# EAGLE design moottoriohjain (EAGLE 7.3.0)
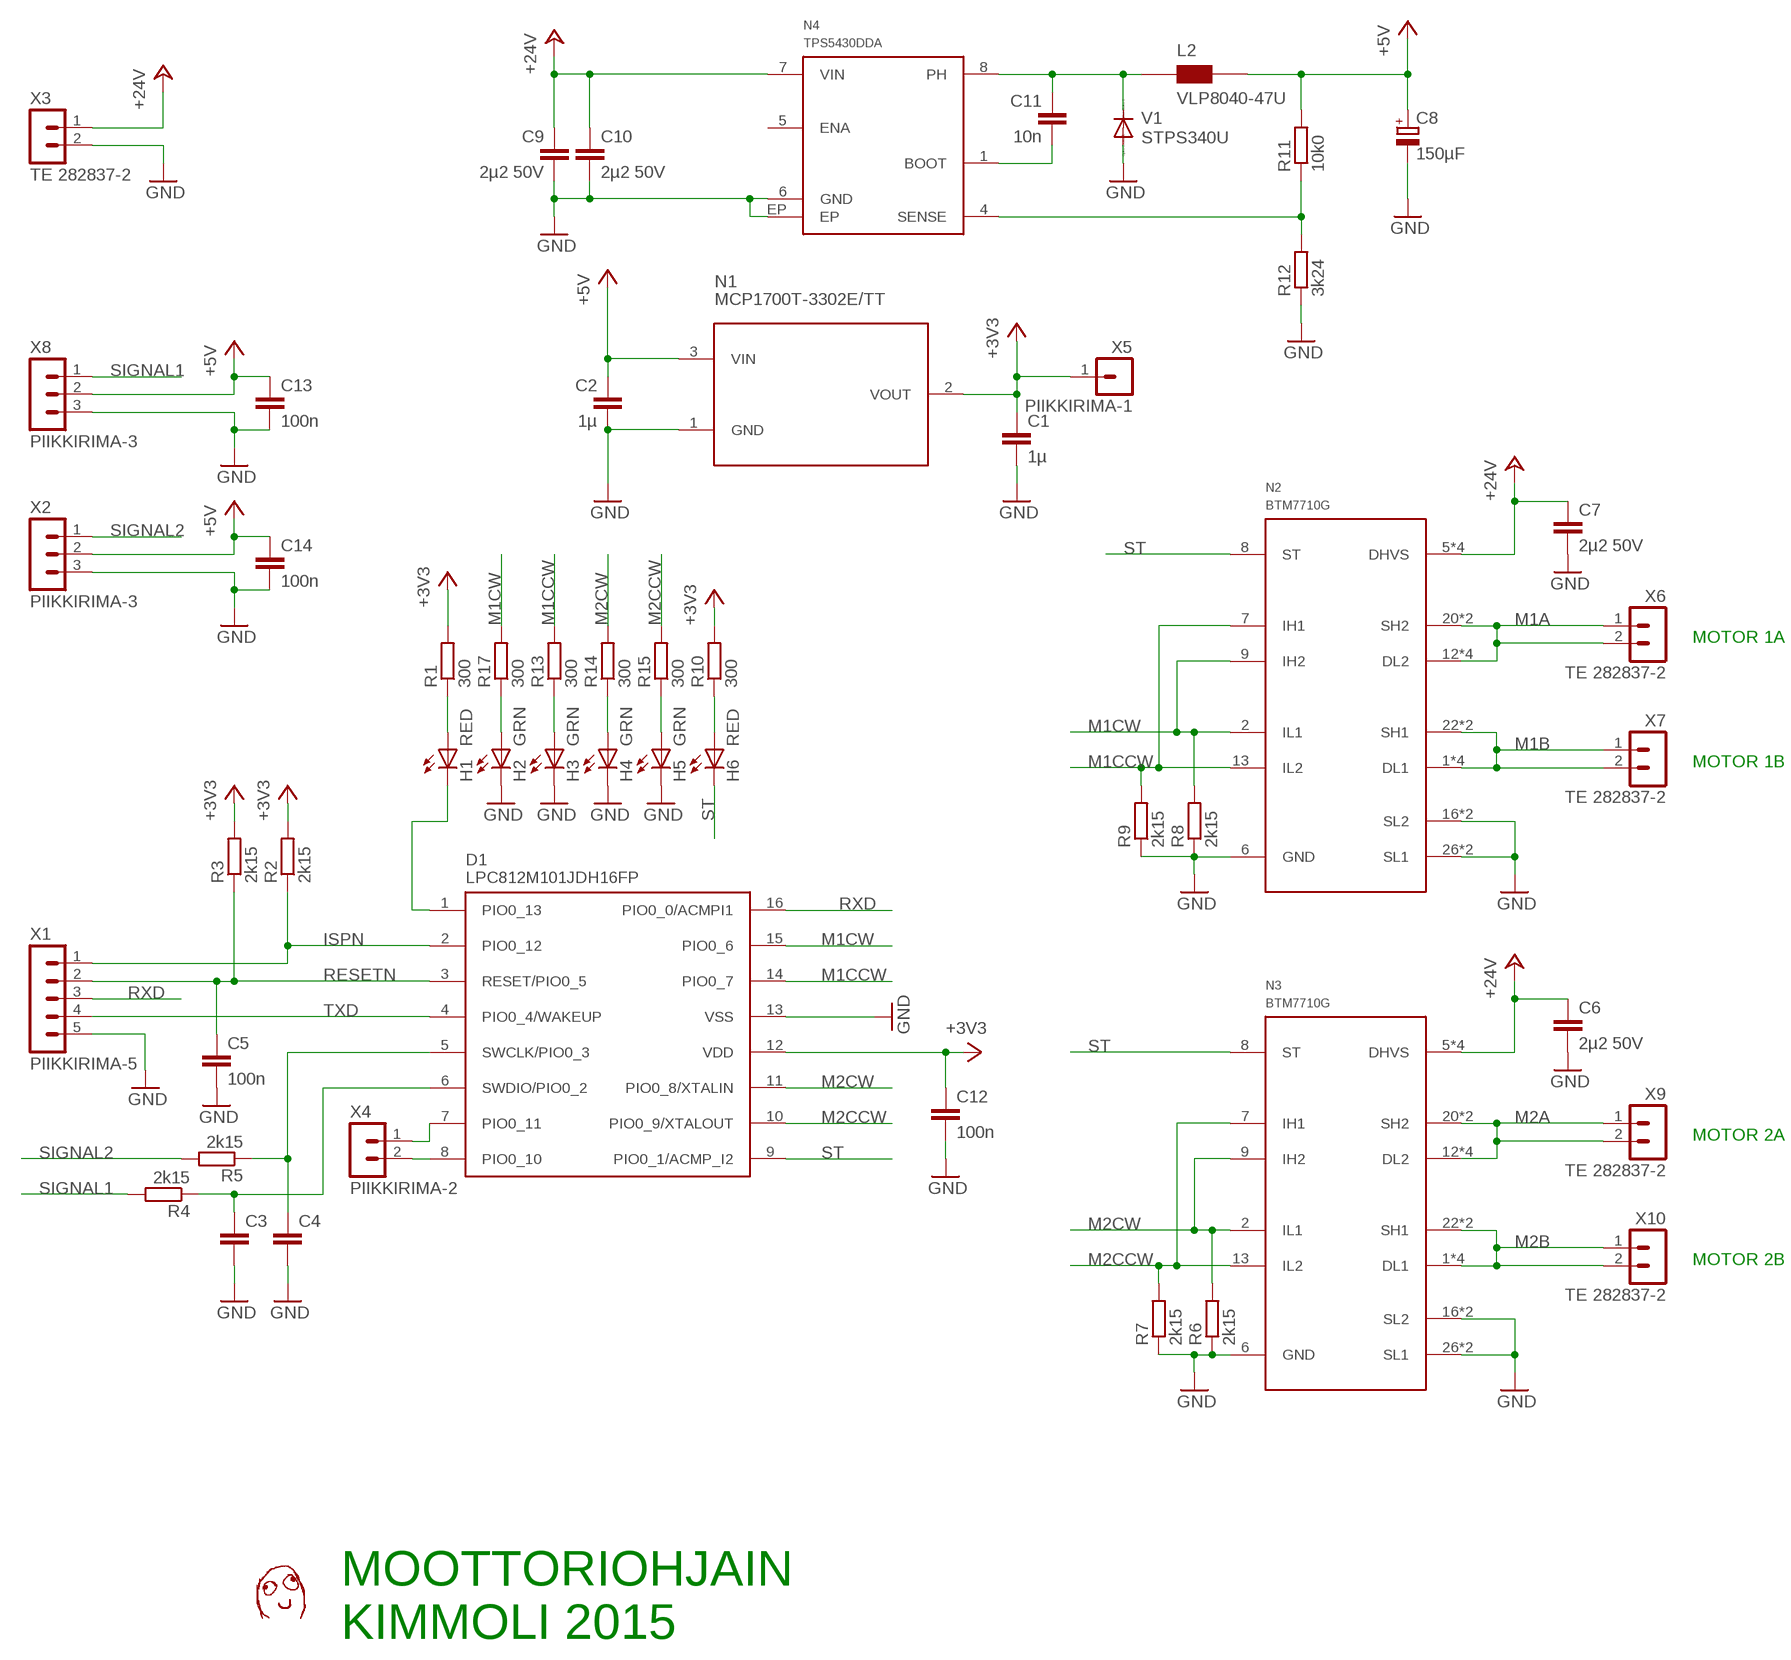
[diagram p0: schematic, sheet 1]

## Parts
C1  1µ  CAP0805  [C0805]
C2  1µ  CAP0805  [C0805]
C3  CAP0603  [C0603]
C4  CAP0603  [C0603]
C5  100n  CAP0603  [C0603]
C6  2µ2 50V  CAP0805  [C0805]
C7  2µ2 50V  CAP0805  [C0805]
C8  150µF  CPOL-EUCT7343  [CT7343]
C9  2µ2 50V  CAP0805  [C0805]
C10  2µ2 50V  CAP0805  [C0805]
C11  10n  CAP0603  [C0603]
C12  100n  CAP0603  [C0603]
C13  100n  CAP0603  [C0603]
C14  100n  CAP0603  [C0603]
D1  LPC812M101JDH16FP  SEB_LPC81X  [SEB_TSSOP16]
H1  RED  LEDCHIP-LED0603  [CHIP-LED0603]
H2  GRN  LEDCHIP-LED0603  [CHIP-LED0603]
H3  GRN  LEDCHIP-LED0603  [CHIP-LED0603]
H4  GRN  LEDCHIP-LED0603  [CHIP-LED0603]
H5  GRN  LEDCHIP-LED0603  [CHIP-LED0603]
H6  RED  LEDCHIP-LED0603  [CHIP-LED0603]
L2  VLP8040-47U  [VLP8040]
N1  MCP1700T-3302E/TT  MCP1700T-1802E/TT  [SOT23]
N2  BTM7710G  [SOIC28-W_MC]
N3  BTM7710G  [SOIC28-W_MC]
N4  TPS5430DDA  [SOIC8-N-EP]
R1  300  RES0603  [R0603]
R2  2k15  RES0603  [R0603]
R3  2k15  RES0603  [R0603]
R4  2k15  RES0603  [R0603]
R5  2k15  RES0603  [R0603]
R6  2k15  RES0603  [R0603]
R7  2k15  RES0603  [R0603]
R8  2k15  RES0603  [R0603]
R9  2k15  RES0603  [R0603]
R10  300  RES0603  [R0603]
R11  10k0  RES0603  [R0603]
R12  3k24  RES0603  [R0603]
R13  300  RES0603  [R0603]
R14  300  RES0603  [R0603]
R15  300  RES0603  [R0603]
R17  300  RES0603  [R0603]
U$1  DAFUG  [DAFUG]
V1  STPS340U  DIODE-SMB  [SMB]
X1  PIIKKIRIMA-5  [PIIKKIRIMA-5]
X2  PIIKKIRIMA-3  [PIIKKIRIMA-3]
X3  TE 282837-2  TE_RUUVILIITIN2  [TE_RUUVILIITIN2]
X4  PIIKKIRIMA-2  [PIIKKIRIMA-2]
X5  PIIKKIRIMA-1  [PIIKKIRIMA-1]
X6  TE 282837-2  TE_RUUVILIITIN2  [TE_RUUVILIITIN2]
X7  TE 282837-2  TE_RUUVILIITIN2  [TE_RUUVILIITIN2]
X8  PIIKKIRIMA-3  [PIIKKIRIMA-3]
X9  TE 282837-2  TE_RUUVILIITIN2  [TE_RUUVILIITIN2]
X10  TE 282837-2  TE_RUUVILIITIN2  [TE_RUUVILIITIN2]

## Nets
+3V3: C1.1 C12.1 D1.12(VDD) N1.2(VOUT) R1.2 R2.2 R3.2 R10.2 X5.1
+5V: C2.1 C8.+ C13.1 C14.1 L2.2(B) N1.3(VIN) R11.2 X2.2 X8.2
+24V: C6.1 C7.1 C9.1 C10.1 N2.5(DHVS) N2.10(DHVS) N2.19(DHVS) N2.24(DHVS) N3.5(DHVS) N3.10(DHVS) N3.19(DHVS) N3.24(DHVS) N4.7(VIN) X3.1
GND: C1.2 C2.2 C3.2 C4.2 C5.2 C6.2 C7.2 C8.- C9.2 C10.2 C12.2 C13.2 C14.2 D1.13(VSS) H2.C H3.C H4.C H5.C N1.1(GND) N2.6(GND) N2.16(SL2) N2.17(SL2) N2.26(SL1) N2.27(SL1) N3.6(GND) N3.16(SL2) N3.17(SL2) N3.26(SL1) N3.27(SL1) N4.6(GND) N4.EP R6.1 R7.1 R8.1 R9.1 R12.1 V1.A X1.5 X2.3 X3.2 X8.3
ISPN: D1.2(PIO0_12) R2.1 X1.1
M1A: N2.12(DL2) N2.14(DL2) N2.15(DL2) N2.18(DL2) N2.20(SH2) N2.21(SH2) X6.1 X6.2
M1B: N2.1(DL1) N2.3(DL1) N2.22(SH1) N2.23(SH1) N2.25(DL1) N2.28(DL1) X7.1 X7.2
M1CCW: D1.14(PIO0_7) N2.7(IH1) N2.13(IL2) R9.2 R13.2
M1CW: D1.15(PIO0_6) N2.2(IL1) N2.9(IH2) R8.2 R17.2
M2A: N3.12(DL2) N3.14(DL2) N3.15(DL2) N3.18(DL2) N3.20(SH2) N3.21(SH2) X9.1 X9.2
M2B: N3.1(DL1) N3.3(DL1) N3.22(SH1) N3.23(SH1) N3.25(DL1) N3.28(DL1) X10.1 X10.2
M2CCW: D1.10(PIO0_9/XTALOUT) N3.7(IH1) N3.13(IL2) R7.2 R15.2
M2CW: D1.11(PIO0_8/XTALIN) N3.2(IL1) N3.9(IH2) R6.2 R14.2
N$1: C3.1 D1.6(SWDIO/PIO0_2) R4.1
N$2: D1.1(PIO0_13) H1.C
N$3: H1.A R1.1
N$4: C4.1 D1.5(SWCLK/PIO0_3) R5.1
N$5: D1.8(PIO0_10) X4.2
N$6: D1.7(PIO0_11) X4.1
N$9: H2.A R17.1
N$10: H6.A R10.1
N$11: H3.A R13.1
N$12: H4.A R14.1
N$13: H5.A R15.1
N$58: C11.2 N4.1(BOOT)
N$60: N4.4(SENSE) R11.1 R12.2
PH: C11.1 L2.1(A) N4.8(PH) V1.C
RESETN: C5.1 D1.3(RESET/PIO0_5) R3.1 X1.2
RXD: D1.16(PIO0_0/ACMPI1) X1.3
SIGNAL1: R4.2 X8.1
SIGNAL2: R5.2 X2.1
ST: D1.9(PIO0_1/ACMP_I2) H6.C N2.8(ST) N3.8(ST)
TXD: D1.4(PIO0_4/WAKEUP) X1.4
Unconnected: N4.5(ENA)

## Notes on the sheet
- MOTOR 1A
- MOTOR 1B
- MOTOR 2A
- MOTOR 2B
- MOOTTORIOHJAIN
- KIMMOLI 2015

## Library data of the parts
C1-C5 C11-C14 = omat_ic_2:CAP
C6 C7 C9 C10 = OMAT_IC:CAP
C8 = EKE:CPOL-EU: POLARIZED CAPACITOR, European symbol
D1 = omat_ic_2:SEB_LPC81X
H1-H6 = omat_ic_2:LED: LED OSRAM: - CHIPLED LG R971, LG N971, LY N971, LG Q971, LY Q971, LO R971, LY R971 LH N974, LH R974 LS Q976, LO Q976, LY Q976 LO Q996 - Hyper CHIPLED LW Q18S LB Q993, LB Q99A, LB R99A - SideLED LS A670, LO A670, LY A670, LG A670, LP A670 LB A673, LV A673, LT A673, LW A673 LH A674 LY A675 LS A676, LA A676, LO A676, LY A676, LW A676 LS A679, LY A679, LG A679 - Hyper Micro SIDELED® LS Y876, LA Y876, LO Y876, LY Y876 LT Y87S - SmartLED LW L88C, LW L88S LB L89C, LB L89S, LG L890 LS L89K, LO L89K, LY L89K LS L896, LA L896, LO L896, LY L896 - TOPLED LS T670, LO T670, LY T670, LG T670, LP T670 LSG T670, LSP T670, LSY T670, LOP T670, LYG T670 LG T671, LOG T671, LSG T671 LB T673, LV T673, LT T673, LW T673 LH T674 LS T676, LA T676, LO T676, LY T676, LB T676, LH T676, LSB T676, LW T676 LB T67C, LV T67C, LT T67C, LS T67K, LO T67K, LY T67K, LW E67C LS E67B, LA E67B, LO E67B, LY E67B, LB E67C, LV E67C, LT E67C LW T67C LS T679, LY T679, LG T679 LS T770, LO T770, LY T770, LG T770, LP T770 LB T773, LV T773, LT T773, LW T773 LH T774 LS E675, LA E675, LY E675, LS T675 LS T776, LA T776, LO T776, LY T776, LB T776 LHGB T686 LT T68C, LB T68C - Hyper Mini TOPLED® LB M676 - Mini TOPLED Santana® LG M470 LS M47K, LO M47K, LY M47K Source: http://www.osram.convergy.de LUXEON: - LUMILED® LXK2-PW12-R00, LXK2-PW12-S00, LXK2-PW14-U00, LXK2-PW14-V00 LXK2-PM12-R00, LXK2-PM12-S00, LXK2-PM14-U00 LXK2-PE12-Q00, LXK2-PE12-R00, LXK2-PE12-S00, LXK2-PE14-T00, LXK2-PE14-U00 LXK2-PB12-K00, LXK2-PB12-L00, LXK2-PB12-M00, LXK2-PB14-N00, LXK2-PB14-P00, LXK2-PB14-Q00 LXK2-PR12-L00, LXK2-PR12-M00, LXK2-PR14-Q00, LXK2-PR14-R00 LXK2-PD12-Q00, LXK2-PD12-R00, LXK2-PD12-S00 LXK2-PH12-R00, LXK2-PH12-S00 LXK2-PL12-P00, LXK2-PL12-Q00, LXK2-PL12-R00 Source: www.luxeon.com KINGBRIGHT: KA-3528ASYC Source: www.kingbright.com
L2 = omat_ic_2:VLP8040
N1 = omat_ic_2:MCP1700T-1802E/TT
N2 N3 = omat_ic_2:BTM7710G
N4 = OMAT_IC:TPS5430
R1-R10 R13-R15 R17 = omat_ic_2:RES
R11 R12 = OMAT_IC:RES
U$1 = dafug:DAFUG
V1 = diode:DIODE-: DIODE
X1 = omat_ic_2:PIIKKIRIMA-5
X2 X8 = omat_ic_2:PIIKKIRIMA-3
X3 X6 X7 X9 X10 = omat_ic_2:TE_RUUVILIITIN2
X4 = omat_ic_2:PIIKKIRIMA-2
X5 = omat_ic_2:PIIKKIRIMA-1

## Board
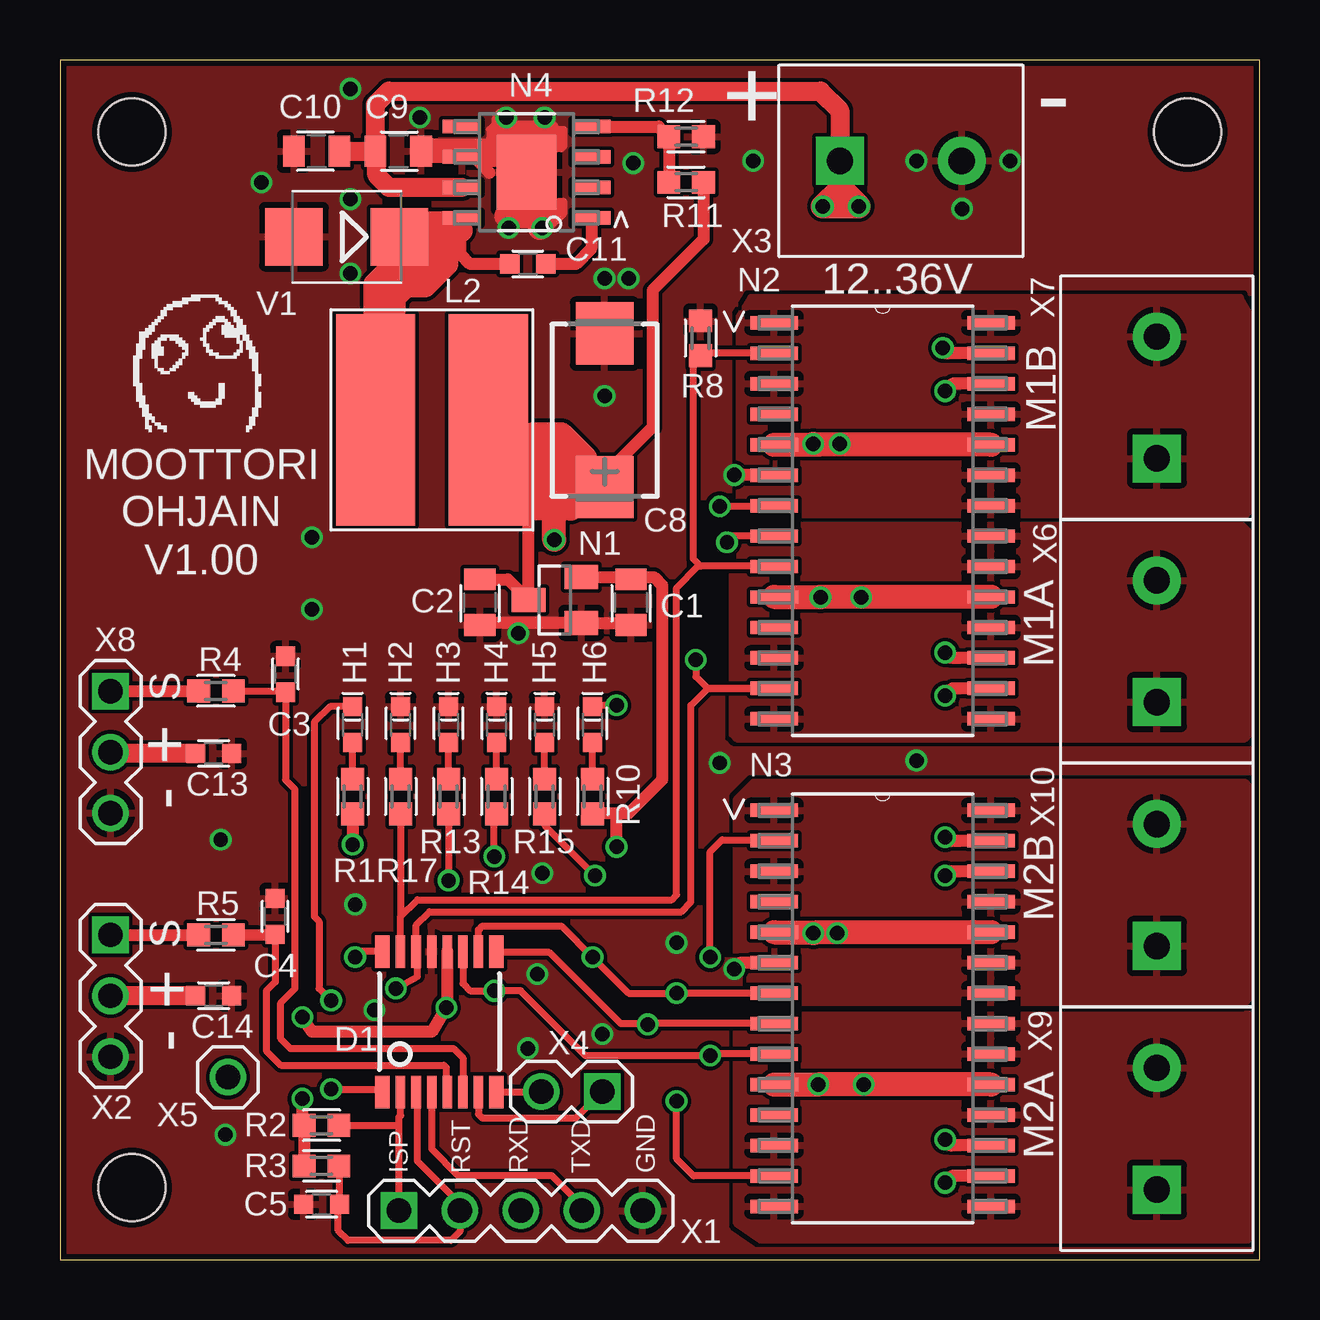
[diagram p1: board, top side]
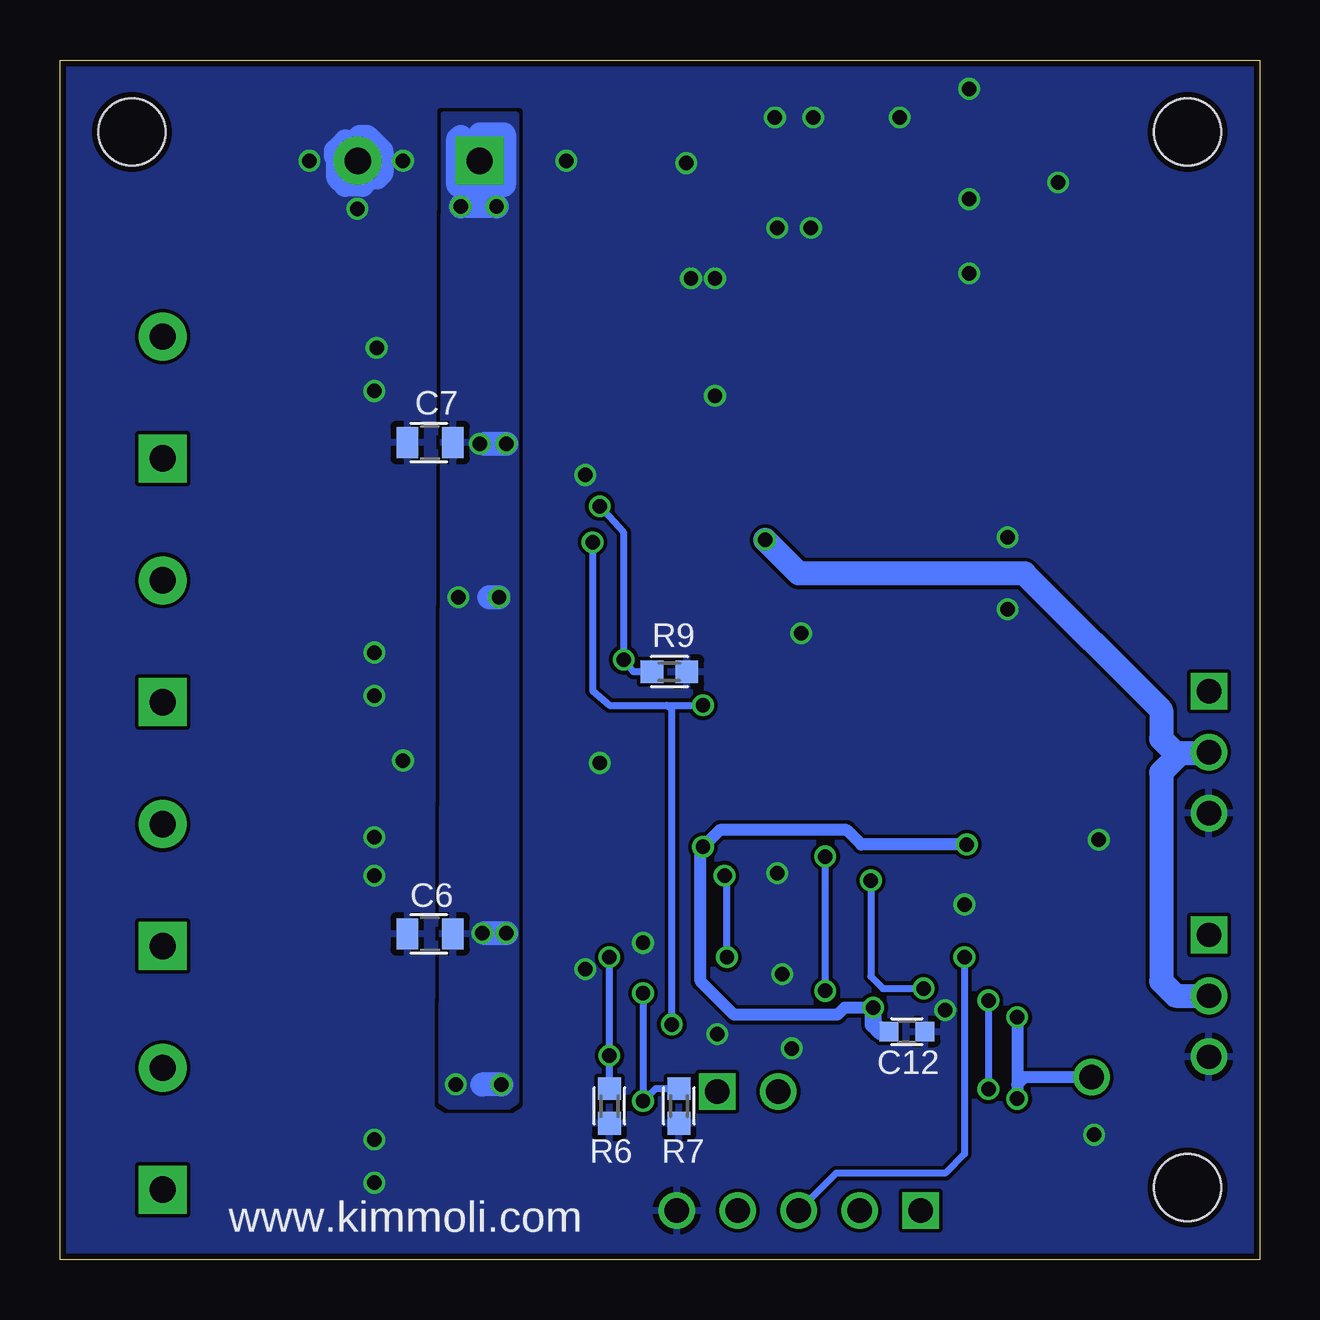
[diagram p2: board, bottom side, seen from below]

Size 50 x 50 mm. Coordinates in mm from the lower left corner, seen from the top.
Outline: 0,0 50,0 50,50 0,50 0,0
Copper layers (1*16): Top 0.035mm / dielectric 1.5mm / Bottom 0.035mm
Design rules "ITEADstudio_DRC": minimum track width 6mil, minimum drill 12mil, track to track 6mil, track to pad 6mil, pad to pad 6mil, via to via 6mil, smd to smd 0mil, copper to edge 10mil, drill to drill 10mil, minimum pad ring 10mil, minimum via ring 6mil, stop-mask expansion 2mil, vias tented up to drill 100mil, thermal gap 10mil
Holes 2.8 mm at 3,3 47,47 3,47

### Footprints (pad centres in the part's own frame; a part is rotated, then mirrored left to right if it is on the bottom)
C0805 = smd 0.9 x 1.3: 1 -0.95,0; 2 0.95,0
C0603 = smd 0.8 x 0.8: 1 -0.75,0; 2 0.75,0
CT7343 = smd 2.6 x 2.4: + 3.2,0; - -3.2,0
SEB_TSSOP16 = smd 0.6 x 1.35: 1 -2.375,-2.925; 8 2.375,-2.925; 9 2.375,2.925; 16 -2.375,2.925 | smd 0.4 x 1.35: 2 -1.625,-2.925; 3 -0.975,-2.925; 4 -0.325,-2.925; 5 0.325,-2.925; 6 0.975,-2.925; 7 1.625,-2.925; 10 1.625,2.925; 11 0.975,2.925; 12 0.325,2.925; 13 -0.325,2.925; 14 -0.975,2.925; 15 -1.625,2.925
CHIP-LED0603 = smd 0.8 x 0.8: A -0.75,0; C 0.75,0
VLP8040 = smd 3.3 x 8.8: 1 -2.35,0; 2 2.35,0
SOT23 = smd 1 x 1.4: 1 -0.95,-1.1; 2 0.95,-1.1; 3 0,1.1
SOIC28-W_MC = smd 1.981 x 0.559: 1 -4.521,8.255; 2 -4.521,6.985; 3 -4.521,5.715; 4 -4.521,4.445; 5 -4.521,3.175; 6 -4.521,1.905; 7 -4.521,0.635; 8 -4.521,-0.635; 9 -4.521,-1.905; 10 -4.521,-3.175; 11 -4.521,-4.445; 12 -4.521,-5.715; 13 -4.521,-6.985; 14 -4.521,-8.255; 15 4.521,-8.255; 16 4.521,-6.985; 17 4.521,-5.715; 18 4.521,-4.445; 19 4.521,-3.175; 20 4.521,-1.905; 21 4.521,-0.635; 22 4.521,0.635; 23 4.521,1.905; 24 4.521,3.175; 25 4.521,4.445; 26 4.521,5.715; 27 4.521,6.985; 28 4.521,8.255
SOIC8-N-EP = smd 1.6 x 0.559: 1 -2.7,1.905; 2 -2.7,0.635; 3 -2.7,-0.635; 4 -2.7,-1.905; 5 2.7,-1.905; 6 2.7,-0.635; 7 2.7,0.635; 8 2.7,1.905 | smd 2.5 x 3.1: EP 0,0
R0603 = smd 0.95 x 0.95: 1 -0.725,0; 2 0.725,0
SMB = smd 2.4 x 2.4: A 2.2,0; C -2.2,0
PIIKKIRIMA-5 = drill 1.016 square: 1 0,0 | drill 1.016: 2 2.54,0; 3 5.08,0; 4 7.62,0; 5 10.16,0
PIIKKIRIMA-3 = drill 1.016 square: 1 0,0 | drill 1.016: 2 2.54,0; 3 5.08,0
TE_RUUVILIITIN2 = drill 1.1 pad 2 square: 1 0,0 | drill 1.1 pad 2: 2 5.08,0
PIIKKIRIMA-2 = drill 1.016 square: 1 0,0 | drill 1.016: 2 2.54,0
PIIKKIRIMA-1 = drill 1.016: 1 0,0

### Placement (x,y rotation side)
C1  23.8,27.4 270 top
C2  17.5,27.4 270 top
C3  9.4,24.4 90 top
C4  8.97,14.3 90 top
C5  10.9,2.3 180 top
C6  34.57,13.57 180 bottom
C7  34.57,34.05 180 bottom
C8  22.7,35.4 270 top
C9  14.1,46.2 0 top
C10  10.7,46.2 180 top
C11  19.5,41.5 0 top
C12  14.7,9.5 0 bottom
C13  6.4,21.1 0 top
C14  6.4,11 0 top
D1  15.82,9.91 0 top
H1  12.2,22.3 90 top
H2  14.2,22.3 90 top
H3  16.2,22.3 90 top
H4  18.2,22.3 90 top
H5  20.2,22.3 90 top
H6  22.2,22.3 90 top
L2  15.5,35 0 top
N1  20.63,27.49 90 top
N2  34.29,30.79 0 top
N3  34.29,10.47 0 top
N4  19.45,45.32 180 top
R1  12.2,19.3 270 top
R2  10.9,5.6 180 top
R3  10.9,3.9 180 top
R4  6.5,23.7 180 top
R5  6.5,13.53 180 top
R6  27.1,6.4 90 bottom
R7  24.2,6.4 90 bottom
R8  26.7,38.4 270 top
R9  24.6,24.5 180 bottom
R10  22.2,19.3 270 top
R11  26.1,44.9 0 top
R12  26.1,46.8 180 top
R13  16.2,19.3 270 top
R14  18.2,19.3 270 top
R15  20.2,19.3 270 top
R17  14.2,19.3 270 top
U$1  5.91,37.1 0 top
V1  11.95,42.63 180 top
X1  14.13,2.04 0 top
X2  2.11,13.53 270 top
X3  32.51,45.8 0 top
X4  22.6,7 180 top
X5  7,7.6 0 top
X6  45.72,23.23 90 top
X7  45.72,33.39 90 top
X8  2.11,23.69 270 top
X9  45.72,2.91 90 top
X10  45.72,13.07 90 top

### Tracks (layer width: path | path; a pad name or v marks a point on that pad's centre or on a via)
+3V3  (via drill 0.6)
  Top 0.5: C1.1 23.71,28.44 N1.2 24.76,28.44 25.1,28.1 25.1,20 23.7,18.6 23.1,18.6 | 23.1,18.6 22.23,18.6 R10.2 | R1.2 v12.2,17.3 | v23.2,17.2 23.2,18.5 23.1,18.6 | D1.12 16.14,10.54 v16.1,10.5 15.5,9.5 10.5,9.5 v10.1,10.1 | R3.2 R2.2 10.1,5.67 v10.1,6.7
  Bottom 0.5: v12.2,17.3 16.6,17.3 17.2,17.9 22.5,17.9 v23.2,17.2 23.3,17.1 23.3,11.6 21.9,10.2 17.6,10.2 17.3,10.5 v16.1,10.5 | v10.1,10.1 10.1,7.3 | 10.1,7.3 v10.1,6.7 | X5.1 9.8,7.6 10.1,7.3
  Bottom 0.7: C12.1 15.8,9.5 16.1,9.8 v16.1,10.5
+5V  (via drill 0.6)
  Top 0.5: R11.2 26.82,42.52 24.7,40.4 24.7,34.7 22.2,32.2 | 19.6,32.3 19.53,32.23 N1.3 18.67,28.35 C2.1
  Top 0.8: C14.1 X2.2 | C13.1 2.16,21.1 X8.2
  Top 1: C8.+ 22.2,32.2 21.3,31.3 19.6,31.3 19.6,32.3 19.6,34.3 19.7,34.4 20.9,34.4 21.9,33.4 21.9,33 20.9,32 20.4,32 20.3,32.1 20.3,33.7 20.5,33.7 20.9,33.3 20.9,32.9 20.5,32.9 | 20.5,32.9 19.95,32.9 L2.2 | v20.6,30 20.6,32.8 20.5,32.9
  Bottom 1: v20.6,30 19.2,28.6 9.8,28.6 4.1,22.9 4.1,21.7 3.5,21.1 3.3,21.1 | X8.2 2.16,21.1 3.3,21.1 | 3.3,21.1 4.1,20.3 4.1,11.6 3.5,11 X2.2
+24V  (via drill 0.6)
  Top 0.8: N4.7 13.71,44.69 13.2,45.2 13.2,46.25 C9.1 | C9.1 13.15,48.15 13.7,48.7 31.7,48.7 32.5,47.9 32.5,46.09 X3.1 | C10.1 C9.1
  Top 1: N2.5 31.57,33.97 v31.4,34 31.64,33.97 N2.24 | N2.19 31.71,27.61 v31.7,27.6 31.68,27.61 N2.10 | N3.5 31.55,13.64 v31.4,13.6 31.64,13.64 N3.24 | N3.10 v31.59,7.29 v31.6,7.3 v31.61,7.29 N3.19 | X3.1 32.5,44.7 | 32.5,44.7 32.5,44.6 v31.8,43.9 v33.3,43.9 32.5,44.7
  Bottom 0.3: X3.1 32.28,46.08 32.2,46
  Bottom 1: v31.4,34 32.3,34 | v31.7,27.6 32.1,27.6 | v31.4,13.6 32.3,13.6 | v31.6,7.3 32.4,7.3 | 32.5,44.7 32.5,44.6 v31.8,43.9 v33.3,43.9 32.5,44.7 | 32.5,44.7 32.5,46.9 31.5,46.9 31.5,44.8 33.4,44.8 33.4,46.7 33.3,46.8
  other vias: 33.5,7.3 32.4,13.6 33.4,27.6 32.5,34
  pour Bottom: 31,6.6 31,47.7 34,47.7 34.1,6.6 33.8,6.4 31.3,6.4
GND  (via drill 0.6)
  Top 0.3: 20.3,47.1 21,47.1 21,46.4 20.9,46.3 20.7,46.3 20.7,46.5 20.8,46.6 20.8,46.9 | v18.6,47.6 18.4,47.6 17.9,47.1 17.9,46.7 17.8,46.6 | 20.1,42.9 20.3,42.9 21,43.6 21,44.1 20.8,44.1 20.8,43.7
  Top 0.5: C1.2 23.71,26.54 N1.1 17.59,26.54 C2.2 | N3.17 37.15,4.75 v36.9,5 | N3.16 37.19,3.48 v36.9,3.2 | N3.6 28.38,12.38 v28.1,12.1 | N3.27 37.05,17.45 v36.9,17.6 | N3.26 37.09,16.18 v36.9,16 | N2.16 37.2,23.8 v36.9,23.5 | N2.17 37.12,25.07 v36.9,25.3 | N2.6 v28.11,32.7 v28.1,32.7 | N2.26 37.2,36.51 v36.9,36.2 | N2.27 37.02,37.77 v36.8,38 | C9.2 15.39,45.95 N4.6 16.7,46 16.7,46.2 16.5,46.4 15.5,46.4 15.5,46.5 18.1,46.5 | 16.9,45.9 17.3,45.9 17.9,45.3 | 18.1,46.5 18.1,46.9 | 18.1,46.5 18.1,45.8 18,45.8 17.7,46.1 17.1,46.1 17,46.2
  Top 1: 18.5,47.5 18.5,47.3 18.8,47 20.2,47 20.3,47.1 | 20,43 20,43.2 20.3,43.5 18.6,43.5
  Bottom 1: X3.2 37.6,46.7 37.5,46.8 37.2,46.8 36.6,46.2 36.6,45.3 36.8,45.1 37.1,45.1 37.4,44.8 38.1,44.8 38.4,45.1 38.4,45.9 38.5,46 38.5,46.2 38.1,46.6
  other vias: 27.5,20.7 35.7,20.8 25.7,13.2 19.9,11.9 22.6,9.4 19.5,8.8 20.2,47.6 20.1,43 18.7,43 22.7,40.9 15,47.6 23.7,40.9 13.1,10.4 12.1,48.8 8.4,44.9 10.5,30.1 10.5,27.1 6.7,17.5 12.3,14.8 20.1,16.1 6.9,5.2 28.9,45.8 23.9,45.7 22.7,36 19.1,26.1 12.1,44.2 12.1,41.1 35.7,45.8 37.6,43.8 39.6,45.8
  pour Top (rank 6): 0,50 50,50 50,0 0,0
  pour Bottom (rank 6): 0,50 49.9,50 49.9,0 0,0
ISPN
  Top 0.3: X1.1 14.13,5.7 | 14.13,5.7 14.13,5.93 14.2,6 D1.2 | R2.1 14.03,5.6 14.13,5.7
M1A
  pour Top: 28.2,21.7 49.4,21.7 49.6,21.9 49.6,30.3 49.3,30.6 28.5,30.6 28,30.1 28,21.9
M1B
  pour Top (rank 2): 28.4,31 49.4,31 49.6,31.2 49.6,39.4 49.2,40.1 28.8,40.1 28.3,39.3 28.3,31.1
M1CCW  (via drill 0.6)
  Top 0.3: 27,23.8 26.3,23.1 26.3,14.9 25.9,14.5 15.4,14.5 14.85,13.95 D1.14 14.9,12.78 14.9,11.8 v14,11.3 | 27,23.8 N2.13 27.09,23.8 | v27.5,31.4 29.74,31.4 N2.7 | R13.2 v16.2,15.8 | v26.5,25 26.5,24.3 27,23.8
  Bottom 0.3: v27.5,31.4 26.5,30.3 v26.5,25 26.1,24.5 R9.2 | v16.2,15.8 16.2,11.8 15.7,11.3 v14,11.3
M1CW
  Top 0.3: D1.15 14.2,14.29 14.2,14.3 | 14.2,14.3 14.9,15 25.5,15 25.7,15.2 25.7,28 26.6,28.9 26.7,28.9 | N2.9 29.75,28.9 26.7,28.9 | 26.7,28.9 26.4,29.2 26.4,37.4 26.7,37.7 | 26.7,37.7 26.8,37.8 29.74,37.8 N2.2 | R17.2 14.2,14.3 | R8.2 26.7,37.7
M2A
  pour Top: 49.5,10.3 49.5,0.8 29.2,0.8 28.2,1.5 28.2,10.1 28.5,10.2 49.4,10.2
M2B
  pour Top (rank 2): 49.6,10.9 49.4,10.7 28.5,10.7 28.2,11 28.2,19.2 28.9,19.9 49.4,19.9 49.6,19.7
M2CCW  (via drill 0.6)
  Top 0.3: D1.10 17.45,13.74 17.6,13.9 20.9,13.9 v22.2,12.6 23.7,11.1 v25.7,11.1 N3.7 | N3.13 26.41,3.48 25.7,4.2 v25.7,6.6 | R15.2 20.2,18.1 v22.3,16
  Bottom 0.3: v25.7,11.1 v25.7,6.6 25.18,7.12 R7.2 | v22.2,12.6 22.2,15.9 v22.3,16
M2CW  (via drill 0.6)
  Top 0.3: D1.11 16.8,11.51 17.1,11.2 v18.1,11.2 18.1,11.1 18.2,11.2 19.2,11.2 21.9,8.5 v27.1,8.5 27.16,8.56 N3.9 | v18.1,16.8 18.1,18.48 R14.2 | v27.1,12.6 27.1,17 27.6,17.5 29.72,17.5 N3.2
  Bottom 0.3: v18.1,11.2 v18.1,16.8 | v27.1,12.6 v27.1,8.5 R6.2
N$1
  Top 0.3: 7.45,23.65 7.4,23.6 | R4.1 9.35,23.7 C3.1 9.4,20 9.8,19.6 9.8,11.3 9.2,10.7 9.2,9.2 9.6,8.8 16.4,8.8 16.8,8.4 D1.6
  Top 0.5: 7.4,23.6 7.33,23.6 R4.1
N$2  (via drill 0.6)
  Top 0.3: H1.C 11.25,23.05 10.6,22.4 10.6,14.3 10.8,14.1 10.8,11.3 v11.3,10.8 | v11.3,7.1 13.33,7.1 D1.1
  Bottom 0.3: v11.3,10.8 v11.3,7.1
N$3
  Top 0.3: R1.1 H1.A
N$4
  Top 0.3: C4.1 8.97,11.57 8.6,11.2 8.6,8.7 9.2,8.1 16,8.1 16.1,8 16.1,7.03 D1.5
  Top 0.5: R5.1 C4.1
N$5
  Top 0.3: D1.8 20.05,6.99 X4.2
N$6
  Top 0.3: D1.7 17.45,6.05 17.6,5.9 21.5,5.9 X4.1
N$9
  Top 0.3: R17.1 H2.A
N$10
  Top 0.3: R10.1 H6.A
N$11
  Top 0.3: R13.1 H3.A
N$12
  Top 0.3: R14.1 H4.A
N$13
  Top 0.3: R15.1 H5.A
N$58
  Top 0.5: N4.1 22.15,42.15 21.5,41.5 C11.2
N$60
  Top 0.5: N4.4 24.95,47.23 R12.2 R11.1
PH
  Top 0.5: C11.1 17.1,41.5 16.7,41.9 16.7,42.9 16.7,43.37 N4.8
  Top 1: 16.7,42.9 16.4,43.2 15,43.2 14.43,42.63 V1.C 13.9,42.38 13.9,40.1 | L2.1 13.15,40.65 13.6,41.1 15.5,41.1 15.5,42.4 16.1,42.4 16.1,41.5 15.2,40.6 14.4,40.6 13.9,40.1 | 13.9,40.1 13.9,39.5
RESETN
  Top 0.3: D1.3 14.9,6.93 14.9,4.1 16.67,2.33 X1.2 16.67,1.17 16.3,0.8 12,0.8 11.6,1.2 11.6,2.25 C5.1 11.65,3.88 R3.1
RXD  (via drill 0.6)
  Top 0.3: D1.16 12.54,12.84 v12.3,12.6
  Bottom 0.3: v12.3,12.6 12.3,4.4 13.1,3.6 17.65,3.6 X1.3
SIGNAL1
  Top 0.5: X8.1 4.46,23.69 R4.2
SIGNAL2
  Top 0.5: X2.1 R5.2
ST  (via drill 0.6)
  Top 0.3: D1.9 18.23,12.8 20.4,12.8 23.36,9.84 24.46,9.84 v24.5,9.8 24.54,9.84 N3.8 | N2.8 27.95,30.16 v27.8,29.9 | v23.2,23.1 22.25,23.1 H6.C
  Bottom 0.3: v27.8,29.9 27.8,23.7 27.1,23.1 24.7,23.1 | 24.7,23.1 v23.2,23.1 | v24.5,9.8 24.5,22.9 24.7,23.1
TXD
  Top 0.3: X1.4 21.75,2.25 20.5,3.5 16.6,3.5 15.5,4.6 D1.4

### Text on the board
tPlace: + | - | 12..36V | M1B | MOOTTORI / OHJAIN | V1.00 | M1A | S | + | - | S | M2B | + | - | ISP | RST | RXD | TXD | GND | M2A
bPlace: www.kimmoli.com